# Altium schematic sheet Accelerometer.SchDoc
size A4; SheetNumber: 2; SheetTotal: 3
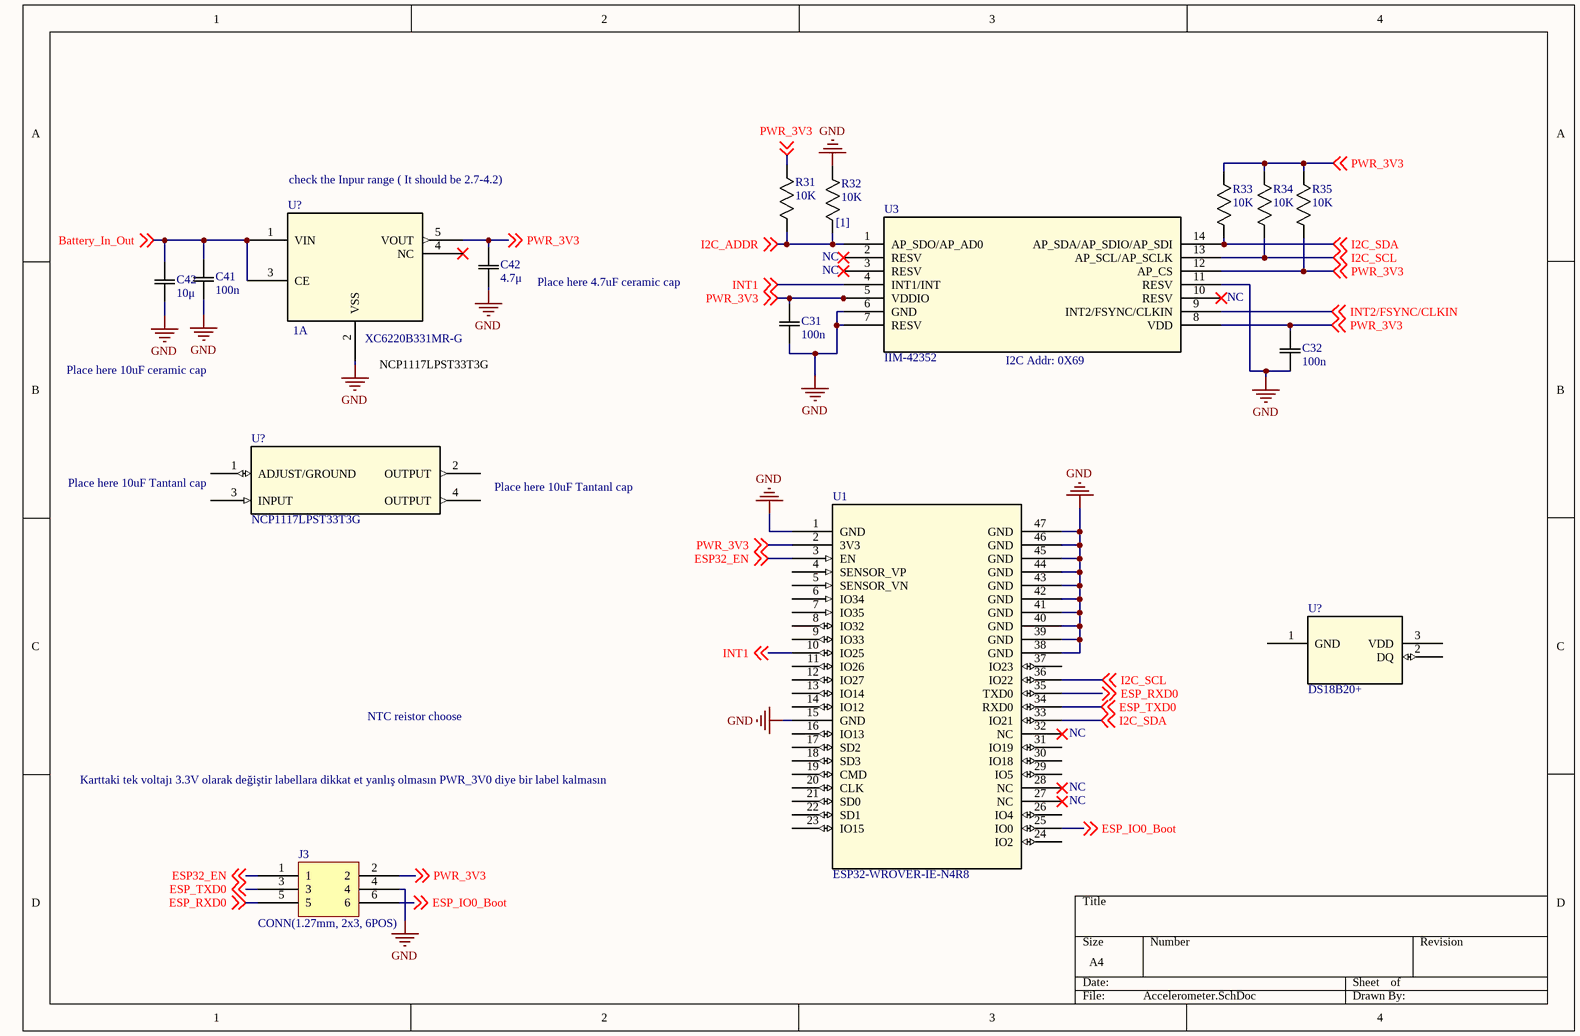
[diagram p0: Accelerometer.SchDoc]

## Parts
(Parts that share a designator on the sheet are numbered #1, #2 ... from top to bottom, then left to right.)
C31  100n  [YAG_CC0603_YAG]
C32  100n  [YAG_CC0603_YAG]
C41  100n  [YAG_CC0603_YAG]
C42#1  4.7μ  [CAPC220145_100N_KEM]
C42#2  10μ  [CAPC220145_100N_KEM]
J3  CONN(1.27mm, 2x3, 6POS)  [SAMTEC_SHF-103-01-L-D-SM]
R31  10K  [RC0603N_VIS]
R32  10K  [RC0603N_VIS]
R33  10K  [RC0603N_VIS]
R34  10K  [RC0603N_VIS]
R35  10K  [RC0603N_VIS]
U1  ESP32-WROVER-IE-N4R8  [ESP32-WROVER-IB_EXP]
U3  IIM-42352  [IIM-42652_TDK]
U?#1  XC6220B331MR-G  [SOT-25_TOR]
U?#2  NCP1117LPST33T3G  [SOT223-3_ONS]
U?#3  DS18B20+  [21-0248A_Q3-1_MXM]

## Nets
GND: C31.1 C32.1 C41.1 C42#1.2 C42#2.2 J3.4 R32.1 U1.1(GND) U1.15(GND) U1.38(GND) U1.39(GND) U1.40(GND) U1.41(GND) U1.42(GND) U1.43(GND) U1.44(GND) U1.45(GND) U1.46(GND) U1.47(GND) U3.6(GND) U3.7(RESV) U3.11(RESV) U?#1.2(VSS)
Battery_In_Out: C41.2 C42#2.1 U?#1.1(VIN) U?#1.3(CE) ; off-sheet Battery_In_Out
ESP32_EN: J3.1 U1.3(EN) ; off-sheet ESP32_EN
ESP_IO0_Boot: J3.6 U1.25(IO0) ; off-sheet ESP_IO0_Boot
ESP_RXD0: J3.5 U1.35(TXD0) ; off-sheet ESP_RXD0
ESP_TXD0: J3.3 U1.34(RXD0) ; off-sheet ESP_TXD0
I2C_ADDR: R31.2 R32.2 U3.1(AP_SDO/AP_AD0) ; off-sheet I2C_ADDR
I2C_SCL: R34.2 U1.36(IO22) U3.13(AP_SCL/AP_SCLK) ; off-sheet I2C_SCL
I2C_SDA: R33.2 U1.33(IO21) U3.14(AP_SDA/AP_SDIO/AP_SDI) ; off-sheet I2C_SDA
INT1: U1.10(IO25) U3.4(INT1/INT) ; off-sheet INT1
INT2/FSYNC/CLKIN: U3.9(INT2/FSYNC/CLKIN) ; off-sheet INT2/FSYNC/CLKIN
PWR_3V3: C31.2 C32.2 C42#1.1 J3.2 R31.1 R33.1 R34.1 R35.1 R35.2 U1.2(3V3) U3.5(VDDIO) U3.8(VDD) U3.12(AP_CS) U?#1.5(VOUT) ; off-sheet PWR_3V3

Not connected (* = marked no-connect by the designer): U1 4(SENSOR_VP) 5(SENSOR_VN) 6(IO34) 7(IO35) 8(IO32) 9(IO33) 11(IO26) 12(IO27) 13(IO14) 14(IO12) 16(IO13) 17(SD2) 18(SD3) 19(CMD) 20(CLK) 21(SD0) 22(SD1) 23(IO15) 24(IO2) 26(IO4) 27(NC)* 28(NC)* 29(IO5) 30(IO18) 31(IO19) 32(NC)* 37(IO23); U3 2(RESV)* 3(RESV)* 10(RESV)*; U?#1 4(NC)*; U?#2 1(ADJUST/GROUND) 2(OUTPUT) 3(INPUT) 4(OUTPUT); U?#3 1(GND) 2(DQ) 3(VDD)

## Notes on the sheet
- check the Inpur range ( It should be 2.7-4.2)
- (near R32) [1]
- (near C42#1) Place here 4.7uF ceramic cap
- NC
- Place here 10uF ceramic cap
- (near U?#1) 1A
- (near U?#1) NCP1117LPST33T3G
- (near U3) I2C Addr: 0X69
- (near U?#2) Place here 10uF Tantanl cap
- Place here 10uF Tantanl cap
- NTC reistor choose
- Karttaki tek voltajı 3.3V olarak değiştir labellara dikkat et yanlış olmasın PWR_3V0 diye bir label kalmasın
- (near U1) NC

## Library data of the parts
C31 C32 C41 = CC0603KRX7R8BB104: No Description Available; Mfr_Name: Yageo; Type: DEV; Copyright: Copyright (C) 2024 Ultra Librarian. All rights reserved.; Manufacturer_Part_Number: CC0603KRX7R8BB104; RefDes: RefDes
C42#1 C42#2 = C0805C105Z4VACTU: No Description Available; Mfr_Name: Kemet; Type: DEV; Copyright: Copyright (C) 2023 Ultra Librarian. All rights reserved.; Manufacturer_Part_Number: C0805C105Z4VACTU; RefDes: RefDes
J3 = SHF-103-01-L-D-SM: Connector Header Surface Mount 6 position 0.050 (1.27mm); MF: Samtec; SnapEDA_Link: https://www.snapeda.com/parts/SHF-103-01-L-D-SM/Samtec/view-part/3351308/?ref=snap; Purchase-URL: https://pricing.snapeda.com/search/part/SHF-103-01-L-D-SM/?ref=eda; Digi-Key_Part_Number: SHF-103-01-L-D-SM-LC-ND; Check_prices: https://www.snapeda.com/parts/SHF-103-01-L-D-SM/Samtec/view-part/3351308/?ref=eda; Value: *; Package: None; MP: SHF-103-01-L-D-SM
R31-R35 = RES(10K, SMD-603): Mfr_Name: Vishay
U1 = ESP32-WROVER-B-N4R8: Mfr_Name: Espressif Systems; Type: RF; RefDes: RefDes
U3 = IIM-42352: No Description Available; Mfr_Name: TDK; RefDes: RefDes; Type: Type
U?#1 = XC6220B331MR-G: No Description Available; Mfr_Name: Torex Semiconductor; RefDes: RefDes; Type: Type
U?#2 = NCP1117LPST33T3G: No Description Available; Mfr_Name: onsemi; RefDes: RefDes; Type: Type
U?#3 = DS18B20+: No Description Available; Mfr_Name: Analog Devices / Maxim Integrated; RefDes: RefDes; Type: Type